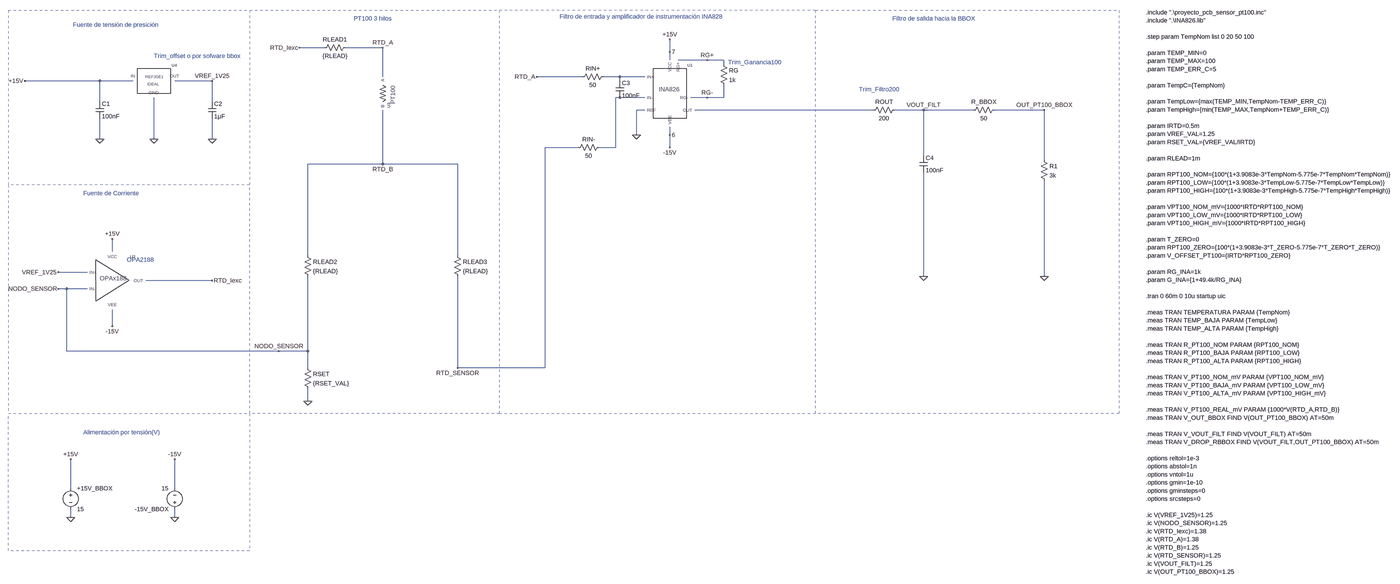
[diagram p0: schematic Sensor_PT100.asc, whole sheet]
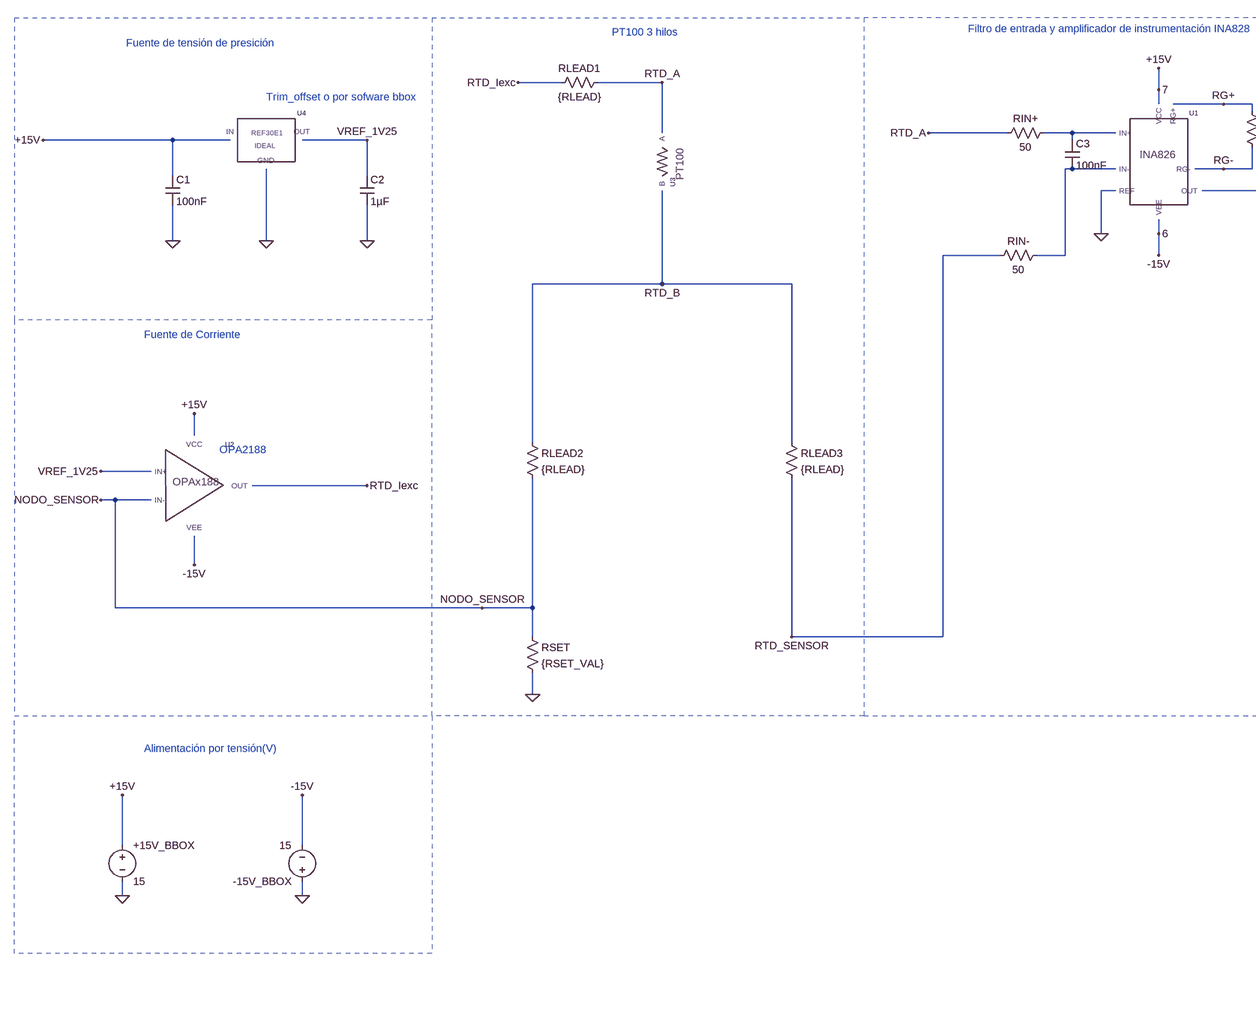
[diagram p1: schematic Sensor_PT100.asc, part, row 1 of 1, column 1 of 2]
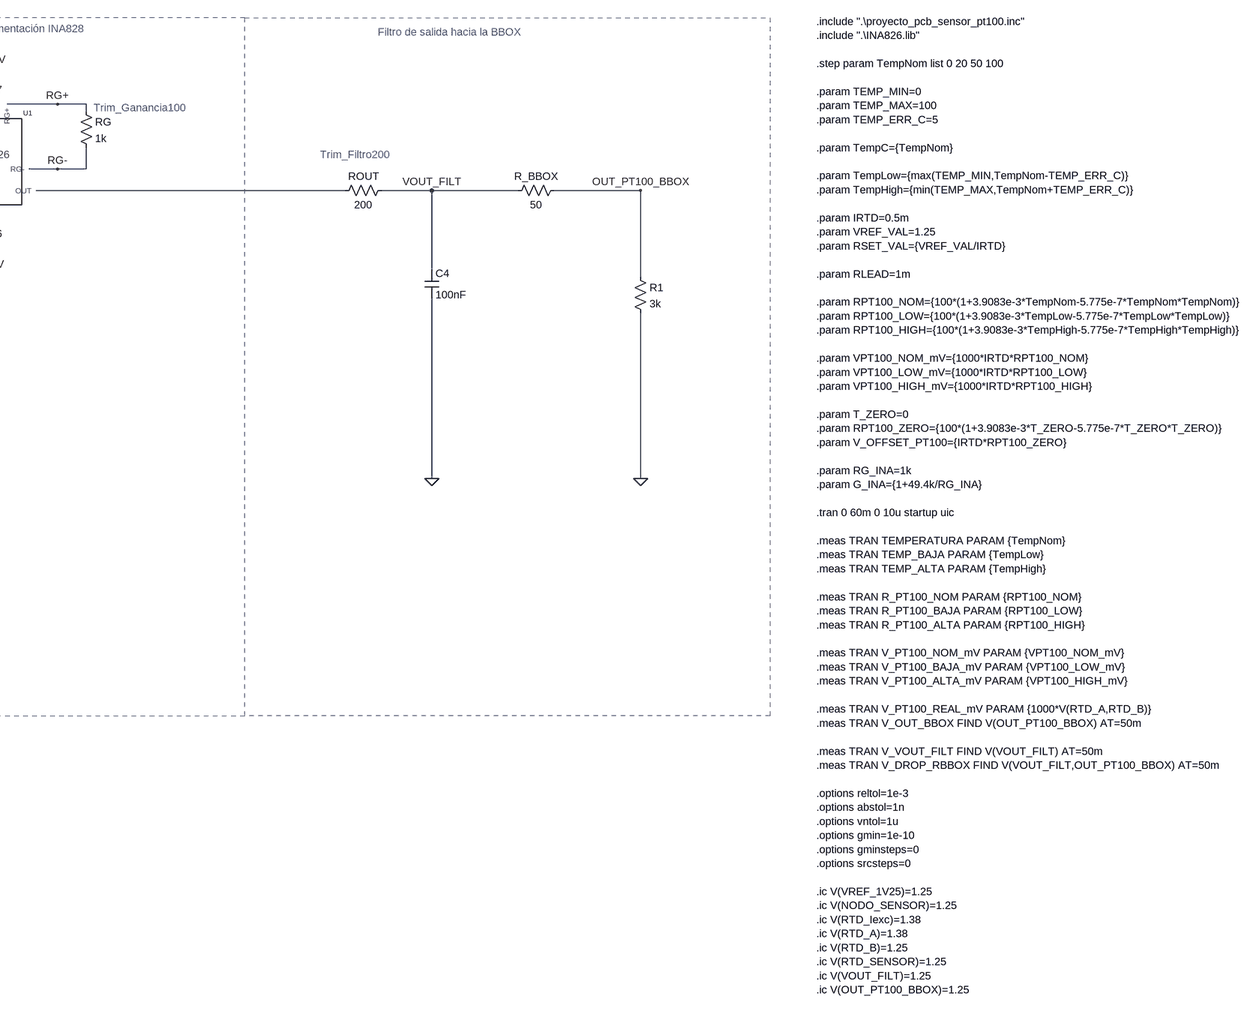
[diagram p2: schematic Sensor_PT100.asc, part, row 1 of 1, column 2 of 2]
Sensor_PT100.asc, the LTspice schematic file:
Version 4.1
SHEET 1 3960 3448
WIRE -640 -1424 -736 -1424
WIRE -416 -1424 -560 -1424
WIRE 688 -1408 688 -1456
WIRE 688 -1376 688 -1408
WIRE 832 -1376 720 -1376
WIRE 896 -1376 832 -1376
WIRE 896 -1360 896 -1376
WIRE -416 -1312 -416 -1424
WIRE 352 -1312 176 -1312
WIRE 496 -1312 432 -1312
WIRE 592 -1312 496 -1312
WIRE -1504 -1296 -1792 -1296
WIRE -1376 -1296 -1504 -1296
WIRE -1072 -1296 -1216 -1296
WIRE 496 -1296 496 -1312
WIRE 496 -1232 480 -1232
WIRE 592 -1232 496 -1232
WIRE 832 -1232 768 -1232
WIRE 896 -1232 896 -1280
WIRE 896 -1232 832 -1232
WIRE -1504 -1216 -1504 -1296
WIRE -1072 -1216 -1072 -1296
WIRE 592 -1184 560 -1184
WIRE 1472 -1184 784 -1184
WIRE 1664 -1184 1552 -1184
WIRE 1856 -1184 1664 -1184
WIRE 2128 -1184 1936 -1184
WIRE 560 -1088 560 -1184
WIRE 688 -1088 688 -1120
WIRE -1504 -1072 -1504 -1152
WIRE -1296 -1072 -1296 -1232
WIRE -1072 -1072 -1072 -1152
WIRE 336 -1040 208 -1040
WIRE 480 -1040 480 -1232
WIRE 480 -1040 416 -1040
WIRE 688 -1040 688 -1088
WIRE 1664 -1008 1664 -1184
WIRE 2128 -992 2128 -1184
WIRE -416 -976 -416 -1184
WIRE -416 -976 -704 -976
WIRE -128 -976 -416 -976
WIRE -1456 -640 -1456 -688
WIRE -704 -624 -704 -976
WIRE -128 -624 -128 -976
WIRE -1552 -560 -1664 -560
WIRE 1664 -544 1664 -944
WIRE 2128 -544 2128 -912
WIRE -1072 -528 -1328 -528
WIRE -1632 -496 -1664 -496
WIRE -1552 -496 -1632 -496
WIRE -1456 -352 -1456 -416
WIRE -1632 -256 -1632 -496
WIRE -816 -256 -1632 -256
WIRE -704 -256 -704 -544
WIRE -704 -256 -816 -256
WIRE -704 -192 -704 -256
WIRE -128 -192 -128 -544
WIRE 208 -192 208 -1040
WIRE 208 -192 -128 -192
WIRE -704 -64 -704 -112
WIRE -1616 272 -1616 160
WIRE -1216 272 -1216 160
WIRE -1616 384 -1616 352
WIRE -1216 384 -1216 352
FLAG -1216 384 0
FLAG -1616 384 0
FLAG -1616 160 +15V
FLAG -1216 160 -15V
FLAG -1664 -560 VREF_1V25
FLAG -1456 -688 +15V
FLAG -1456 -352 -15V
FLAG -704 -64 0
FLAG -1664 -496 NODO_SENSOR
FLAG -1072 -528 RTD_Iexc
FLAG -1504 -1072 0
FLAG -1792 -1296 +15V
FLAG -1296 -1072 0
FLAG -1072 -1072 0
FLAG -1072 -1296 VREF_1V25
FLAG -736 -1424 RTD_Iexc
FLAG 688 -1456 +15V
FLAG 688 -1408 7
FLAG 176 -1312 RTD_A
FLAG -416 -1424 RTD_A
FLAG -416 -976 RTD_B
FLAG 688 -1040 -15V
FLAG 688 -1088 6
FLAG 832 -1376 RG+
FLAG 832 -1232 RG-
FLAG 1664 -1184 VOUT_FILT
FLAG 1664 -544 0
FLAG 2128 -1184 OUT_PT100_BBOX
FLAG -816 -256 NODO_SENSOR
FLAG 2128 -544 0
FLAG 560 -1088 0
FLAG -128 -192 RTD_SENSOR
SYMBOL voltage -1616 256 R0
WINDOW 123 0 0 Left 0
SYMATTR InstName +15V_BBOX
SYMATTR Value 15
SYMATTR SpiceLine Rser=0.05
SYMBOL voltage -1216 368 R180
WINDOW 123 0 0 Left 0
SYMATTR InstName -15V_BBOX
SYMATTR Value 15
SYMATTR SpiceLine Rser=0.05
SYMBOL res -720 -208 R0
SYMATTR InstName RSET
SYMATTR Value {RSET_VAL}
SYMATTR SpiceLine tol=0.01
SYMBOL cap -1520 -1216 R0
SYMATTR InstName C1
SYMATTR Value 100nF
SYMBOL PCB_PT100_SM50\\REF30E1_IDEAL -1296 -1296 R0
SYMATTR InstName U4
SYMBOL cap -1088 -1216 R0
SYMATTR InstName C2
SYMATTR Value 1µF
SYMBOL res -544 -1440 R90
WINDOW 0 0 56 VBottom 2
WINDOW 3 32 56 VTop 2
SYMATTR InstName RLEAD1
SYMATTR Value {RLEAD}
SYMBOL res -720 -640 R0
SYMATTR InstName RLEAD2
SYMATTR Value {RLEAD}
SYMBOL res -144 -640 R0
SYMATTR InstName RLEAD3
SYMATTR Value {RLEAD}
SYMBOL res 448 -1328 R90
WINDOW 0 0 56 VBottom 2
WINDOW 3 32 56 VTop 2
SYMATTR InstName RIN+
SYMATTR Value 50
SYMBOL res 880 -1376 R0
SYMATTR InstName RG
SYMATTR Value 1k
SYMBOL res 432 -1056 R90
WINDOW 0 0 56 VBottom 2
WINDOW 3 32 56 VTop 2
SYMATTR InstName RIN-
SYMATTR Value 50
SYMBOL res 1568 -1200 R90
WINDOW 0 0 56 VBottom 2
WINDOW 3 32 56 VTop 2
SYMATTR InstName ROUT
SYMATTR Value 200
SYMBOL cap 1648 -1008 R0
SYMATTR InstName C4
SYMATTR Value 100nF
SYMBOL res 1952 -1200 R90
WINDOW 0 0 56 VBottom 2
WINDOW 3 32 56 VTop 2
SYMATTR InstName R_BBOX
SYMATTR Value 50
SYMBOL PCB_PT100_SM50\\PT100_CLEAN -416 -1248 R90
SYMATTR InstName U3
SYMBOL cap 480 -1296 R0
SYMATTR InstName C3
SYMATTR Value 100nF
SYMBOL OPAx188 -1456 -528 R0
SYMATTR InstName U2
SYMBOL res 2112 -1008 R0
SYMATTR InstName R1
SYMATTR Value 3k
SYMBOL INA826 688 -1248 R0
SYMATTR InstName U1
TEXT -1568 56 Left 2 ;Alimentación por tensión(V)
TEXT -1608 -1512 Left 2 ;Fuente de tensión de presición
TEXT -1568 -864 Left 2 ;Fuente de Corriente
TEXT -528 -1536 Left 2 ;PT100 3 hilos
TEXT 264 -1544 Left 2 ;Filtro de entrada y amplificador de instrumentación INA828
TEXT 1544 -1536 Left 2 ;Filtro de salida hacia la BBOX
TEXT 2544 -1560 Left 2 !.include ".\\proyecto_pcb_sensor_pt100.inc"\n.include ".\\INA826.lib"\n \n.step param TempNom list 0 20 50 100\n \n.param TEMP_MIN=0\n.param TEMP_MAX=100\n.param TEMP_ERR_C=5\n \n.param TempC={TempNom}\n \n.param TempLow={max(TEMP_MIN,TempNom-TEMP_ERR_C)}\n.param TempHigh={min(TEMP_MAX,TempNom+TEMP_ERR_C)}\n \n.param IRTD=0.5m\n.param VREF_VAL=1.25\n.param RSET_VAL={VREF_VAL/IRTD}\n \n.param RLEAD=1m\n \n.param RPT100_NOM={100*(1+3.9083e-3*TempNom-5.775e-7*TempNom*TempNom)}\n.param RPT100_LOW={100*(1+3.9083e-3*TempLow-5.775e-7*TempLow*TempLow)}\n.param RPT100_HIGH={100*(1+3.9083e-3*TempHigh-5.775e-7*TempHigh*TempHigh)}\n \n.param VPT100_NOM_mV={1000*IRTD*RPT100_NOM}\n.param VPT100_LOW_mV={1000*IRTD*RPT100_LOW}\n.param VPT100_HIGH_mV={1000*IRTD*RPT100_HIGH}\n \n.param T_ZERO=0\n.param RPT100_ZERO={100*(1+3.9083e-3*T_ZERO-5.775e-7*T_ZERO*T_ZERO)}\n.param V_OFFSET_PT100={IRTD*RPT100_ZERO}\n \n.param RG_INA=1k\n.param G_INA={1+49.4k/RG_INA}\n \n.tran 0 60m 0 10u startup uic\n \n.meas TRAN TEMPERATURA PARAM {TempNom}\n.meas TRAN TEMP_BAJA PARAM {TempLow}\n.meas TRAN TEMP_ALTA PARAM {TempHigh}\n \n.meas TRAN R_PT100_NOM PARAM {RPT100_NOM}\n.meas TRAN R_PT100_BAJA PARAM {RPT100_LOW}\n.meas TRAN R_PT100_ALTA PARAM {RPT100_HIGH}\n \n.meas TRAN V_PT100_NOM_mV PARAM {VPT100_NOM_mV}\n.meas TRAN V_PT100_BAJA_mV PARAM {VPT100_LOW_mV}\n.meas TRAN V_PT100_ALTA_mV PARAM {VPT100_HIGH_mV}\n \n.meas TRAN V_PT100_REAL_mV PARAM {1000*V(RTD_A,RTD_B)}\n.meas TRAN V_OUT_BBOX FIND V(OUT_PT100_BBOX) AT=50m\n \n.meas TRAN V_VOUT_FILT FIND V(VOUT_FILT) AT=50m\n.meas TRAN V_DROP_RBBOX FIND V(VOUT_FILT,OUT_PT100_BBOX) AT=50m\n \n.options reltol=1e-3\n.options abstol=1n\n.options vntol=1u\n.options gmin=1e-10\n.options gminsteps=0\n.options srcsteps=0\n \n.ic V(VREF_1V25)=1.25\n.ic V(NODO_SENSOR)=1.25\n.ic V(RTD_Iexc)=1.38\n.ic V(RTD_A)=1.38\n.ic V(RTD_B)=1.25\n.ic V(RTD_SENSOR)=1.25\n.ic V(VOUT_FILT)=1.25\n.ic V(OUT_PT100_BBOX)=1.25
TEXT 912 -1368 Left 2 ;Trim_Ganancia100
TEXT 1416 -1264 Left 2 ;Trim_Filtro200
TEXT -1296 -1392 Left 2 ;Trim_offset o por sofware bbox
TEXT -1400 -608 Left 2 ;OPA2188
LINE Normal -928 -896 -1856 -896 4
LINE Normal -928 -16 -928 -896 4
LINE Normal -1856 -16 -928 -16 4
LINE Normal -1856 -896 -1856 -16 4
LINE Normal -1856 -1568 -1856 -896 4
LINE Normal -928 -1568 -928 -896 4
LINE Normal -1856 -1568 -928 -1568 4
LINE Normal 32 -16 -928 -16 4
LINE Normal 32 -1568 32 -16 4
LINE Normal -928 -1568 32 -1568 4
LINE Normal 1248 -1568 32 -1568 4
LINE Normal 1248 -16 1248 -1568 4
LINE Normal 32 -16 1248 -16 4
LINE Normal 2416 -16 1248 -16 4
LINE Normal 2416 -1568 2416 -16 4
LINE Normal 1248 -1568 2416 -1568 4
LINE Normal -928 -16 -928 512 4
LINE Normal -1856 512 -1856 -16 4
LINE Normal -928 512 -1856 512 4

The netlist it stands for:
* Sensor_PT100.asc
V§+15V_BBOX 7 0 15 Rser=0.05
V§-15V_BBOX 0 6 15 Rser=0.05
RSET NODO_SENSOR 0 {RSET_VAL} tol=0.01
C1 7 0 100nF
X§U4 7 0 VREF_1V25 REF30E1_IDEAL  ; pins IN GND OUT
C2 VREF_1V25 0 1µF
RLEAD1 RTD_A RTD_Iexc {RLEAD}
RLEAD2 RTD_B NODO_SENSOR {RLEAD}
RLEAD3 RTD_B RTD_SENSOR {RLEAD}
RIN+ N001 RTD_A 50
RG RG+ RG- 1k
RIN- N002 RTD_SENSOR 50
ROUT VOUT_FILT N003 200
C4 VOUT_FILT 0 100nF
R_BBOX OUT_PT100_BBOX VOUT_FILT 50
X§U3 RTD_A RTD_B PT100 sensT={TempC}  ; pins A B
C3 N001 N002 100nF
X§U2 VREF_1V25 NODO_SENSOR 7 6 RTD_Iexc OPAx188  ; pins IN+ IN- VCC VEE OUT
R1 OUT_PT100_BBOX 0 3k
X§U1 N001 N002 7 6 N003 0 RG+ RG- INA826  ; pins IN+ IN- VCC VEE OUT REF RG+ RG-
* Alimentación por tensión(V)
* Fuente de tensión de presición
* Fuente de Corriente
* PT100 3 hilos
* Filtro de entrada y amplificador de instrumentación INA828
* Filtro de salida hacia la BBOX
.include ".\proyecto_pcb_sensor_pt100.inc"
.include ".\INA826.lib"
.step param TempNom list 0 20 50 100
.param TEMP_MIN=0
.param TEMP_MAX=100
.param TEMP_ERR_C=5
.param TempC={TempNom}
.param TempLow={max(TEMP_MIN,TempNom-TEMP_ERR_C)}
.param TempHigh={min(TEMP_MAX,TempNom+TEMP_ERR_C)}
.param IRTD=0.5m
.param VREF_VAL=1.25
.param RSET_VAL={VREF_VAL/IRTD}
.param RLEAD=1m
.param RPT100_NOM={100*(1+3.9083e-3*TempNom-5.775e-7*TempNom*TempNom)}
.param RPT100_LOW={100*(1+3.9083e-3*TempLow-5.775e-7*TempLow*TempLow)}
.param RPT100_HIGH={100*(1+3.9083e-3*TempHigh-5.775e-7*TempHigh*TempHigh)}
.param VPT100_NOM_mV={1000*IRTD*RPT100_NOM}
.param VPT100_LOW_mV={1000*IRTD*RPT100_LOW}
.param VPT100_HIGH_mV={1000*IRTD*RPT100_HIGH}
.param T_ZERO=0
.param RPT100_ZERO={100*(1+3.9083e-3*T_ZERO-5.775e-7*T_ZERO*T_ZERO)}
.param V_OFFSET_PT100={IRTD*RPT100_ZERO}
.param RG_INA=1k
.param G_INA={1+49.4k/RG_INA}
.tran 0 60m 0 10u startup uic
.meas TRAN TEMPERATURA PARAM {TempNom}
.meas TRAN TEMP_BAJA PARAM {TempLow}
.meas TRAN TEMP_ALTA PARAM {TempHigh}
.meas TRAN R_PT100_NOM PARAM {RPT100_NOM}
.meas TRAN R_PT100_BAJA PARAM {RPT100_LOW}
.meas TRAN R_PT100_ALTA PARAM {RPT100_HIGH}
.meas TRAN V_PT100_NOM_mV PARAM {VPT100_NOM_mV}
.meas TRAN V_PT100_BAJA_mV PARAM {VPT100_LOW_mV}
.meas TRAN V_PT100_ALTA_mV PARAM {VPT100_HIGH_mV}
.meas TRAN V_PT100_REAL_mV PARAM {1000*V(RTD_A,RTD_B)}
.meas TRAN V_OUT_BBOX FIND V(OUT_PT100_BBOX) AT=50m
.meas TRAN V_VOUT_FILT FIND V(VOUT_FILT) AT=50m
.meas TRAN V_DROP_RBBOX FIND V(VOUT_FILT,OUT_PT100_BBOX) AT=50m
.options reltol=1e-3
.options abstol=1n
.options vntol=1u
.options gmin=1e-10
.options gminsteps=0
.options srcsteps=0
.ic V(VREF_1V25)=1.25
.ic V(NODO_SENSOR)=1.25
.ic V(RTD_Iexc)=1.38
.ic V(RTD_A)=1.38
.ic V(RTD_B)=1.25
.ic V(RTD_SENSOR)=1.25
.ic V(VOUT_FILT)=1.25
.ic V(OUT_PT100_BBOX)=1.25
* Trim_Ganancia100
* Trim_Filtro200
* Trim_offset o por sofware bbox
* OPA2188
.backanno
.end